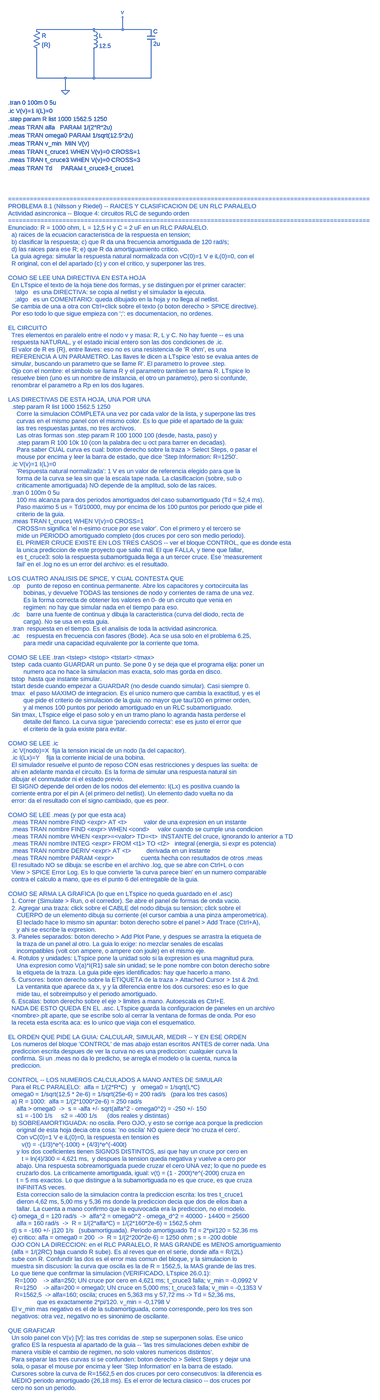
[diagram p0: schematic P8-01_RLC_paralelo_clasificacion.asc, whole sheet]
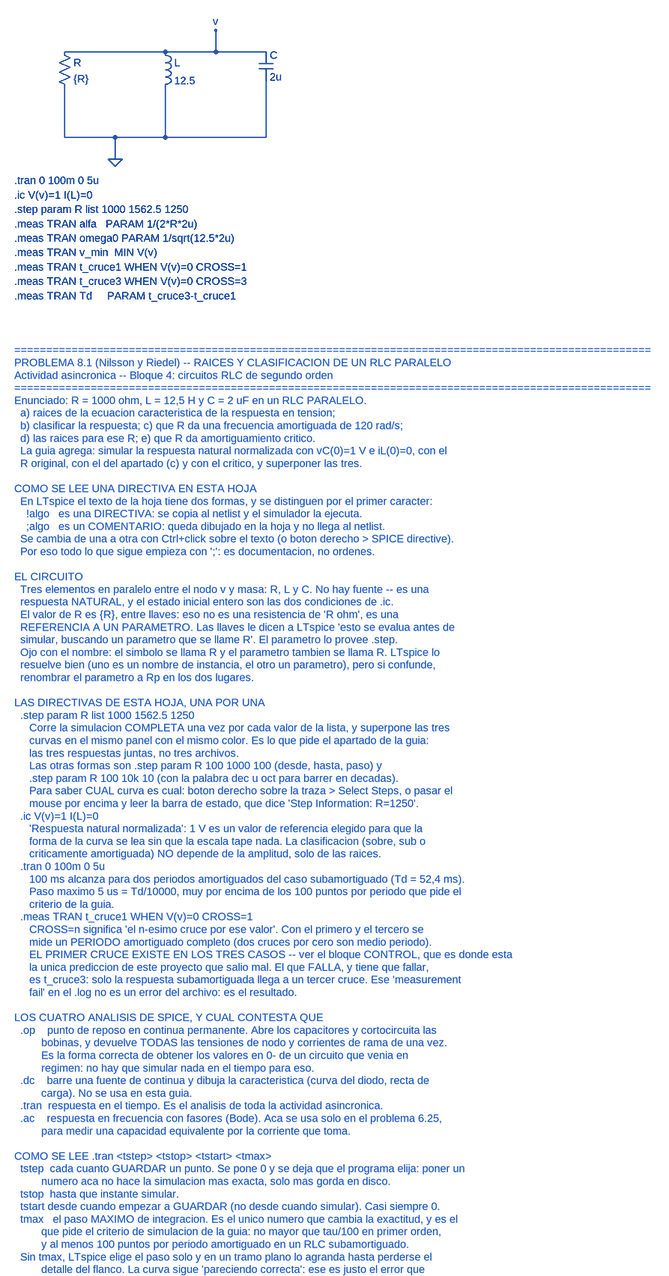
[diagram p1: schematic P8-01_RLC_paralelo_clasificacion.asc, part, row 1 of 2, column 1 of 1]
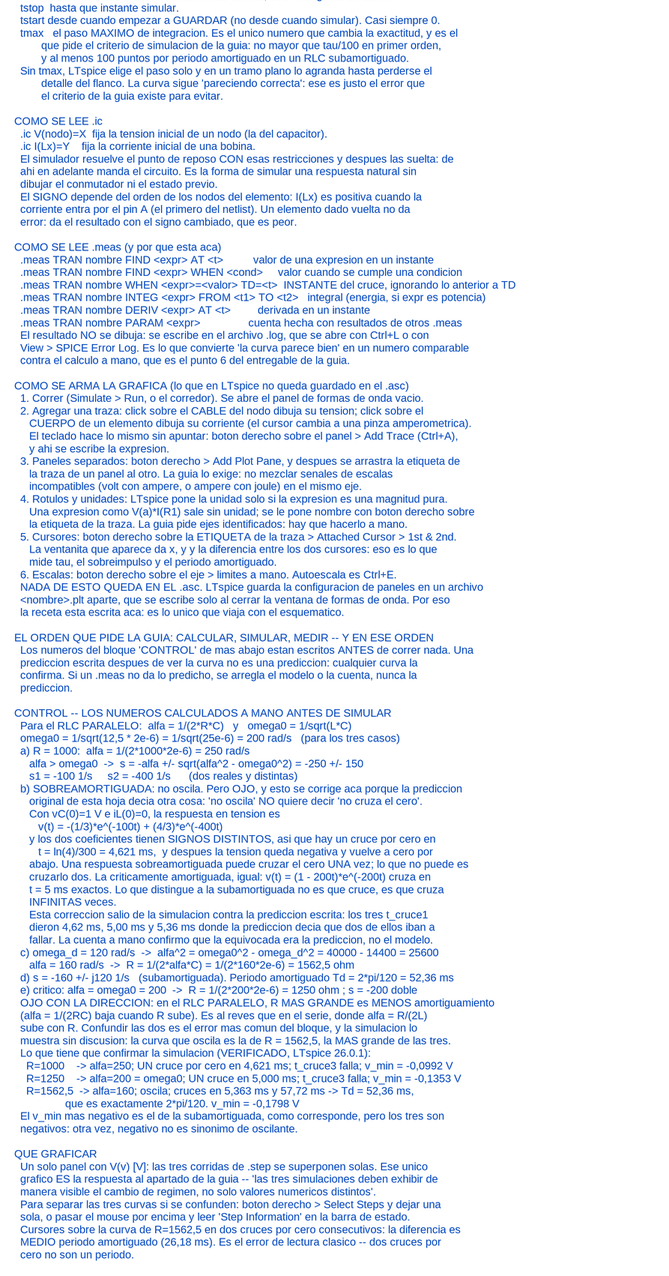
[diagram p2: schematic P8-01_RLC_paralelo_clasificacion.asc, part, row 2 of 2, column 1 of 1]
P8-01_RLC_paralelo_clasificacion.asc, the LTspice schematic file:
Version 4
SHEET 1 2200 2800
WIRE 176 192 176 304
WIRE 400 192 400 304
WIRE 624 176 624 304
WIRE 176 112 624 112
WIRE 176 304 624 304
WIRE 288 304 288 352
WIRE 512 112 512 64
FLAG 288 352 0
FLAG 512 64 v
SYMBOL res 160 96 R0
SYMATTR InstName R
SYMATTR Value {R}
SYMBOL ind 384 96 R0
SYMATTR InstName L
SYMATTR Value 12.5
SYMATTR Value2 Rser=0
SYMBOL cap 608 112 R0
SYMATTR InstName C
SYMATTR Value 2u
TEXT 64 400 Left 2 !.tran 0 100m 0 5u
TEXT 64 432 Left 2 !.ic V(v)=1 I(L)=0
TEXT 64 464 Left 2 !.step param R list 1000 1562.5 1250
TEXT 64 496 Left 2 !.meas TRAN alfa   PARAM 1/(2*R*2u)
TEXT 64 528 Left 2 !.meas TRAN omega0 PARAM 1/sqrt(12.5*2u)
TEXT 64 560 Left 2 !.meas TRAN v_min  MIN V(v)
TEXT 64 592 Left 2 !.meas TRAN t_cruce1 WHEN V(v)=0 CROSS=1
TEXT 64 624 Left 2 !.meas TRAN t_cruce3 WHEN V(v)=0 CROSS=3
TEXT 64 656 Left 2 !.meas TRAN Td     PARAM t_cruce3-t_cruce1
TEXT 64 900 Left 2 ;====================================================================================================
TEXT 64 928 Left 2 ;PROBLEMA 8.1 (Nilsson y Riedel) -- RAICES Y CLASIFICACION DE UN RLC PARALELO
TEXT 64 956 Left 2 ;Actividad asincronica -- Bloque 4: circuitos RLC de segundo orden
TEXT 64 984 Left 2 ;====================================================================================================
TEXT 64 1012 Left 2 ;Enunciado: R = 1000 ohm, L = 12,5 H y C = 2 uF en un RLC PARALELO.
TEXT 64 1040 Left 2 ;  a) raices de la ecuacion caracteristica de la respuesta en tension;
TEXT 64 1068 Left 2 ;  b) clasificar la respuesta; c) que R da una frecuencia amortiguada de 120 rad/s;
TEXT 64 1096 Left 2 ;  d) las raices para ese R; e) que R da amortiguamiento critico.
TEXT 64 1124 Left 2 ;  La guia agrega: simular la respuesta natural normalizada con vC(0)=1 V e iL(0)=0, con el
TEXT 64 1152 Left 2 ;  R original, con el del apartado (c) y con el critico, y superponer las tres.
TEXT 64 1180 Left 2 ;
TEXT 64 1208 Left 2 ;COMO SE LEE UNA DIRECTIVA EN ESTA HOJA
TEXT 64 1236 Left 2 ;  En LTspice el texto de la hoja tiene dos formas, y se distinguen por el primer caracter:
TEXT 64 1264 Left 2 ;    !algo   es una DIRECTIVA: se copia al netlist y el simulador la ejecuta.
TEXT 64 1292 Left 2 ;    ;algo   es un COMENTARIO: queda dibujado en la hoja y no llega al netlist.
TEXT 64 1320 Left 2 ;  Se cambia de una a otra con Ctrl+click sobre el texto (o boton derecho > SPICE directive).
TEXT 64 1348 Left 2 ;  Por eso todo lo que sigue empieza con ';': es documentacion, no ordenes.
TEXT 64 1376 Left 2 ;
TEXT 64 1404 Left 2 ;EL CIRCUITO
TEXT 64 1432 Left 2 ;  Tres elementos en paralelo entre el nodo v y masa: R, L y C. No hay fuente -- es una
TEXT 64 1460 Left 2 ;  respuesta NATURAL, y el estado inicial entero son las dos condiciones de .ic.
TEXT 64 1488 Left 2 ;  El valor de R es {R}, entre llaves: eso no es una resistencia de 'R ohm', es una
TEXT 64 1516 Left 2 ;  REFERENCIA A UN PARAMETRO. Las llaves le dicen a LTspice 'esto se evalua antes de
TEXT 64 1544 Left 2 ;  simular, buscando un parametro que se llame R'. El parametro lo provee .step.
TEXT 64 1572 Left 2 ;  Ojo con el nombre: el simbolo se llama R y el parametro tambien se llama R. LTspice lo
TEXT 64 1600 Left 2 ;  resuelve bien (uno es un nombre de instancia, el otro un parametro), pero si confunde,
TEXT 64 1628 Left 2 ;  renombrar el parametro a Rp en los dos lugares.
TEXT 64 1656 Left 2 ;
TEXT 64 1684 Left 2 ;LAS DIRECTIVAS DE ESTA HOJA, UNA POR UNA
TEXT 64 1712 Left 2 ;  .step param R list 1000 1562.5 1250
TEXT 64 1740 Left 2 ;     Corre la simulacion COMPLETA una vez por cada valor de la lista, y superpone las tres
TEXT 64 1768 Left 2 ;     curvas en el mismo panel con el mismo color. Es lo que pide el apartado de la guia:
TEXT 64 1796 Left 2 ;     las tres respuestas juntas, no tres archivos.
TEXT 64 1824 Left 2 ;     Las otras formas son .step param R 100 1000 100 (desde, hasta, paso) y
TEXT 64 1852 Left 2 ;     .step param R 100 10k 10 (con la palabra dec u oct para barrer en decadas).
TEXT 64 1880 Left 2 ;     Para saber CUAL curva es cual: boton derecho sobre la traza > Select Steps, o pasar el
TEXT 64 1908 Left 2 ;     mouse por encima y leer la barra de estado, que dice 'Step Information: R=1250'.
TEXT 64 1936 Left 2 ;  .ic V(v)=1 I(L)=0
TEXT 64 1964 Left 2 ;     'Respuesta natural normalizada': 1 V es un valor de referencia elegido para que la
TEXT 64 1992 Left 2 ;     forma de la curva se lea sin que la escala tape nada. La clasificacion (sobre, sub o
TEXT 64 2020 Left 2 ;     criticamente amortiguada) NO depende de la amplitud, solo de las raices.
TEXT 64 2048 Left 2 ;  .tran 0 100m 0 5u
TEXT 64 2076 Left 2 ;     100 ms alcanza para dos periodos amortiguados del caso subamortiguado (Td = 52,4 ms).
TEXT 64 2104 Left 2 ;     Paso maximo 5 us = Td/10000, muy por encima de los 100 puntos por periodo que pide el
TEXT 64 2132 Left 2 ;     criterio de la guia.
TEXT 64 2160 Left 2 ;  .meas TRAN t_cruce1 WHEN V(v)=0 CROSS=1
TEXT 64 2188 Left 2 ;     CROSS=n significa 'el n-esimo cruce por ese valor'. Con el primero y el tercero se
TEXT 64 2216 Left 2 ;     mide un PERIODO amortiguado completo (dos cruces por cero son medio periodo).
TEXT 64 2244 Left 2 ;     EL PRIMER CRUCE EXISTE EN LOS TRES CASOS -- ver el bloque CONTROL, que es donde esta
TEXT 64 2272 Left 2 ;     la unica prediccion de este proyecto que salio mal. El que FALLA, y tiene que fallar,
TEXT 64 2300 Left 2 ;     es t_cruce3: solo la respuesta subamortiguada llega a un tercer cruce. Ese 'measurement
TEXT 64 2328 Left 2 ;     fail' en el .log no es un error del archivo: es el resultado.
TEXT 64 2356 Left 2 ;
TEXT 64 2384 Left 2 ;LOS CUATRO ANALISIS DE SPICE, Y CUAL CONTESTA QUE
TEXT 64 2412 Left 2 ;  .op    punto de reposo en continua permanente. Abre los capacitores y cortocircuita las
TEXT 64 2440 Left 2 ;         bobinas, y devuelve TODAS las tensiones de nodo y corrientes de rama de una vez.
TEXT 64 2468 Left 2 ;         Es la forma correcta de obtener los valores en 0- de un circuito que venia en
TEXT 64 2496 Left 2 ;         regimen: no hay que simular nada en el tiempo para eso.
TEXT 64 2524 Left 2 ;  .dc    barre una fuente de continua y dibuja la caracteristica (curva del diodo, recta de
TEXT 64 2552 Left 2 ;         carga). No se usa en esta guia.
TEXT 64 2580 Left 2 ;  .tran  respuesta en el tiempo. Es el analisis de toda la actividad asincronica.
TEXT 64 2608 Left 2 ;  .ac    respuesta en frecuencia con fasores (Bode). Aca se usa solo en el problema 6.25,
TEXT 64 2636 Left 2 ;         para medir una capacidad equivalente por la corriente que toma.
TEXT 64 2664 Left 2 ;
TEXT 64 2692 Left 2 ;COMO SE LEE .tran <tstep> <tstop> <tstart> <tmax>
TEXT 64 2720 Left 2 ;  tstep  cada cuanto GUARDAR un punto. Se pone 0 y se deja que el programa elija: poner un
TEXT 64 2748 Left 2 ;         numero aca no hace la simulacion mas exacta, solo mas gorda en disco.
TEXT 64 2776 Left 2 ;  tstop  hasta que instante simular.
TEXT 64 2804 Left 2 ;  tstart desde cuando empezar a GUARDAR (no desde cuando simular). Casi siempre 0.
TEXT 64 2832 Left 2 ;  tmax   el paso MAXIMO de integracion. Es el unico numero que cambia la exactitud, y es el
TEXT 64 2860 Left 2 ;         que pide el criterio de simulacion de la guia: no mayor que tau/100 en primer orden,
TEXT 64 2888 Left 2 ;         y al menos 100 puntos por periodo amortiguado en un RLC subamortiguado.
TEXT 64 2916 Left 2 ;  Sin tmax, LTspice elige el paso solo y en un tramo plano lo agranda hasta perderse el
TEXT 64 2944 Left 2 ;         detalle del flanco. La curva sigue 'pareciendo correcta': ese es justo el error que
TEXT 64 2972 Left 2 ;         el criterio de la guia existe para evitar.
TEXT 64 3000 Left 2 ;
TEXT 64 3028 Left 2 ;COMO SE LEE .ic
TEXT 64 3056 Left 2 ;  .ic V(nodo)=X  fija la tension inicial de un nodo (la del capacitor).
TEXT 64 3084 Left 2 ;  .ic I(Lx)=Y    fija la corriente inicial de una bobina.
TEXT 64 3112 Left 2 ;  El simulador resuelve el punto de reposo CON esas restricciones y despues las suelta: de
TEXT 64 3140 Left 2 ;  ahi en adelante manda el circuito. Es la forma de simular una respuesta natural sin
TEXT 64 3168 Left 2 ;  dibujar el conmutador ni el estado previo.
TEXT 64 3196 Left 2 ;  El SIGNO depende del orden de los nodos del elemento: I(Lx) es positiva cuando la
TEXT 64 3224 Left 2 ;  corriente entra por el pin A (el primero del netlist). Un elemento dado vuelta no da
TEXT 64 3252 Left 2 ;  error: da el resultado con el signo cambiado, que es peor.
TEXT 64 3280 Left 2 ;
TEXT 64 3308 Left 2 ;COMO SE LEE .meas (y por que esta aca)
TEXT 64 3336 Left 2 ;  .meas TRAN nombre FIND <expr> AT <t>          valor de una expresion en un instante
TEXT 64 3364 Left 2 ;  .meas TRAN nombre FIND <expr> WHEN <cond>     valor cuando se cumple una condicion
TEXT 64 3392 Left 2 ;  .meas TRAN nombre WHEN <expr>=<valor> TD=<t>  INSTANTE del cruce, ignorando lo anterior a TD
TEXT 64 3420 Left 2 ;  .meas TRAN nombre INTEG <expr> FROM <t1> TO <t2>   integral (energia, si expr es potencia)
TEXT 64 3448 Left 2 ;  .meas TRAN nombre DERIV <expr> AT <t>         derivada en un instante
TEXT 64 3476 Left 2 ;  .meas TRAN nombre PARAM <expr>                cuenta hecha con resultados de otros .meas
TEXT 64 3504 Left 2 ;  El resultado NO se dibuja: se escribe en el archivo .log, que se abre con Ctrl+L o con
TEXT 64 3532 Left 2 ;  View > SPICE Error Log. Es lo que convierte 'la curva parece bien' en un numero comparable
TEXT 64 3560 Left 2 ;  contra el calculo a mano, que es el punto 6 del entregable de la guia.
TEXT 64 3588 Left 2 ;
TEXT 64 3616 Left 2 ;COMO SE ARMA LA GRAFICA (lo que en LTspice no queda guardado en el .asc)
TEXT 64 3644 Left 2 ;  1. Correr (Simulate > Run, o el corredor). Se abre el panel de formas de onda vacio.
TEXT 64 3672 Left 2 ;  2. Agregar una traza: click sobre el CABLE del nodo dibuja su tension; click sobre el
TEXT 64 3700 Left 2 ;     CUERPO de un elemento dibuja su corriente (el cursor cambia a una pinza amperometrica).
TEXT 64 3728 Left 2 ;     El teclado hace lo mismo sin apuntar: boton derecho sobre el panel > Add Trace (Ctrl+A),
TEXT 64 3756 Left 2 ;     y ahi se escribe la expresion.
TEXT 64 3784 Left 2 ;  3. Paneles separados: boton derecho > Add Plot Pane, y despues se arrastra la etiqueta de
TEXT 64 3812 Left 2 ;     la traza de un panel al otro. La guia lo exige: no mezclar senales de escalas
TEXT 64 3840 Left 2 ;     incompatibles (volt con ampere, o ampere con joule) en el mismo eje.
TEXT 64 3868 Left 2 ;  4. Rotulos y unidades: LTspice pone la unidad solo si la expresion es una magnitud pura.
TEXT 64 3896 Left 2 ;     Una expresion como V(a)*I(R1) sale sin unidad; se le pone nombre con boton derecho sobre
TEXT 64 3924 Left 2 ;     la etiqueta de la traza. La guia pide ejes identificados: hay que hacerlo a mano.
TEXT 64 3952 Left 2 ;  5. Cursores: boton derecho sobre la ETIQUETA de la traza > Attached Cursor > 1st & 2nd.
TEXT 64 3980 Left 2 ;     La ventanita que aparece da x, y y la diferencia entre los dos cursores: eso es lo que
TEXT 64 4008 Left 2 ;     mide tau, el sobreimpulso y el periodo amortiguado.
TEXT 64 4036 Left 2 ;  6. Escalas: boton derecho sobre el eje > limites a mano. Autoescala es Ctrl+E.
TEXT 64 4064 Left 2 ;  NADA DE ESTO QUEDA EN EL .asc. LTspice guarda la configuracion de paneles en un archivo
TEXT 64 4092 Left 2 ;  <nombre>.plt aparte, que se escribe solo al cerrar la ventana de formas de onda. Por eso
TEXT 64 4120 Left 2 ;  la receta esta escrita aca: es lo unico que viaja con el esquematico.
TEXT 64 4148 Left 2 ;
TEXT 64 4176 Left 2 ;EL ORDEN QUE PIDE LA GUIA: CALCULAR, SIMULAR, MEDIR -- Y EN ESE ORDEN
TEXT 64 4204 Left 2 ;  Los numeros del bloque 'CONTROL' de mas abajo estan escritos ANTES de correr nada. Una
TEXT 64 4232 Left 2 ;  prediccion escrita despues de ver la curva no es una prediccion: cualquier curva la
TEXT 64 4260 Left 2 ;  confirma. Si un .meas no da lo predicho, se arregla el modelo o la cuenta, nunca la
TEXT 64 4288 Left 2 ;  prediccion.
TEXT 64 4316 Left 2 ;
TEXT 64 4344 Left 2 ;CONTROL -- LOS NUMEROS CALCULADOS A MANO ANTES DE SIMULAR
TEXT 64 4372 Left 2 ;  Para el RLC PARALELO:  alfa = 1/(2*R*C)   y   omega0 = 1/sqrt(L*C)
TEXT 64 4400 Left 2 ;  omega0 = 1/sqrt(12,5 * 2e-6) = 1/sqrt(25e-6) = 200 rad/s   (para los tres casos)
TEXT 64 4428 Left 2 ;  a) R = 1000:  alfa = 1/(2*1000*2e-6) = 250 rad/s
TEXT 64 4456 Left 2 ;     alfa > omega0  ->  s = -alfa +/- sqrt(alfa^2 - omega0^2) = -250 +/- 150
TEXT 64 4484 Left 2 ;     s1 = -100 1/s     s2 = -400 1/s      (dos reales y distintas)
TEXT 64 4512 Left 2 ;  b) SOBREAMORTIGUADA: no oscila. Pero OJO, y esto se corrige aca porque la prediccion
TEXT 64 4540 Left 2 ;     original de esta hoja decia otra cosa: 'no oscila' NO quiere decir 'no cruza el cero'.
TEXT 64 4568 Left 2 ;     Con vC(0)=1 V e iL(0)=0, la respuesta en tension es
TEXT 64 4596 Left 2 ;        v(t) = -(1/3)*e^(-100t) + (4/3)*e^(-400t)
TEXT 64 4624 Left 2 ;     y los dos coeficientes tienen SIGNOS DISTINTOS, asi que hay un cruce por cero en
TEXT 64 4652 Left 2 ;        t = ln(4)/300 = 4,621 ms,  y despues la tension queda negativa y vuelve a cero por
TEXT 64 4680 Left 2 ;     abajo. Una respuesta sobreamortiguada puede cruzar el cero UNA vez; lo que no puede es
TEXT 64 4708 Left 2 ;     cruzarlo dos. La criticamente amortiguada, igual: v(t) = (1 - 200t)*e^(-200t) cruza en
TEXT 64 4736 Left 2 ;     t = 5 ms exactos. Lo que distingue a la subamortiguada no es que cruce, es que cruza
TEXT 64 4764 Left 2 ;     INFINITAS veces.
TEXT 64 4792 Left 2 ;     Esta correccion salio de la simulacion contra la prediccion escrita: los tres t_cruce1
TEXT 64 4820 Left 2 ;     dieron 4,62 ms, 5,00 ms y 5,36 ms donde la prediccion decia que dos de ellos iban a
TEXT 64 4848 Left 2 ;     fallar. La cuenta a mano confirmo que la equivocada era la prediccion, no el modelo.
TEXT 64 4876 Left 2 ;  c) omega_d = 120 rad/s  ->  alfa^2 = omega0^2 - omega_d^2 = 40000 - 14400 = 25600
TEXT 64 4904 Left 2 ;     alfa = 160 rad/s  ->  R = 1/(2*alfa*C) = 1/(2*160*2e-6) = 1562,5 ohm
TEXT 64 4932 Left 2 ;  d) s = -160 +/- j120 1/s   (subamortiguada). Periodo amortiguado Td = 2*pi/120 = 52,36 ms
TEXT 64 4960 Left 2 ;  e) critico: alfa = omega0 = 200  ->  R = 1/(2*200*2e-6) = 1250 ohm ; s = -200 doble
TEXT 64 4988 Left 2 ;  OJO CON LA DIRECCION: en el RLC PARALELO, R MAS GRANDE es MENOS amortiguamiento
TEXT 64 5016 Left 2 ;  (alfa = 1/(2RC) baja cuando R sube). Es al reves que en el serie, donde alfa = R/(2L)
TEXT 64 5044 Left 2 ;  sube con R. Confundir las dos es el error mas comun del bloque, y la simulacion lo
TEXT 64 5072 Left 2 ;  muestra sin discusion: la curva que oscila es la de R = 1562,5, la MAS grande de las tres.
TEXT 64 5100 Left 2 ;  Lo que tiene que confirmar la simulacion (VERIFICADO, LTspice 26.0.1):
TEXT 64 5128 Left 2 ;    R=1000    -> alfa=250; UN cruce por cero en 4,621 ms; t_cruce3 falla; v_min = -0,0992 V
TEXT 64 5156 Left 2 ;    R=1250    -> alfa=200 = omega0; UN cruce en 5,000 ms; t_cruce3 falla; v_min = -0,1353 V
TEXT 64 5184 Left 2 ;    R=1562,5  -> alfa=160; oscila; cruces en 5,363 ms y 57,72 ms -> Td = 52,36 ms,
TEXT 64 5212 Left 2 ;                 que es exactamente 2*pi/120. v_min = -0,1798 V
TEXT 64 5240 Left 2 ;  El v_min mas negativo es el de la subamortiguada, como corresponde, pero los tres son
TEXT 64 5268 Left 2 ;  negativos: otra vez, negativo no es sinonimo de oscilante.
TEXT 64 5296 Left 2 ;
TEXT 64 5324 Left 2 ;QUE GRAFICAR
TEXT 64 5352 Left 2 ;  Un solo panel con V(v) [V]: las tres corridas de .step se superponen solas. Ese unico
TEXT 64 5380 Left 2 ;  grafico ES la respuesta al apartado de la guia -- 'las tres simulaciones deben exhibir de
TEXT 64 5408 Left 2 ;  manera visible el cambio de regimen, no solo valores numericos distintos'.
TEXT 64 5436 Left 2 ;  Para separar las tres curvas si se confunden: boton derecho > Select Steps y dejar una
TEXT 64 5464 Left 2 ;  sola, o pasar el mouse por encima y leer 'Step Information' en la barra de estado.
TEXT 64 5492 Left 2 ;  Cursores sobre la curva de R=1562,5 en dos cruces por cero consecutivos: la diferencia es
TEXT 64 5520 Left 2 ;  MEDIO periodo amortiguado (26,18 ms). Es el error de lectura clasico -- dos cruces por
TEXT 64 5548 Left 2 ;  cero no son un periodo.

The netlist it stands for:
* P8-01_RLC_paralelo_clasificacion.asc
R v 0 {R}
L v 0 12.5 Rser=0
C v 0 2u
.tran 0 100m 0 5u
.ic V(v)=1 I(L)=0
.step param R list 1000 1562.5 1250
.meas TRAN alfa   PARAM 1/(2*R*2u)
.meas TRAN omega0 PARAM 1/sqrt(12.5*2u)
.meas TRAN v_min  MIN V(v)
.meas TRAN t_cruce1 WHEN V(v)=0 CROSS=1
.meas TRAN t_cruce3 WHEN V(v)=0 CROSS=3
.meas TRAN Td     PARAM t_cruce3-t_cruce1
* ====================================================================================================
* PROBLEMA 8.1 (Nilsson y Riedel) -- RAICES Y CLASIFICACION DE UN RLC PARALELO
* Actividad asincronica -- Bloque 4: circuitos RLC de segundo orden
* ====================================================================================================
* Enunciado: R = 1000 ohm, L = 12,5 H y C = 2 uF en un RLC PARALELO.
*   a) raices de la ecuacion caracteristica de la respuesta en tension;
*   b) clasificar la respuesta; c) que R da una frecuencia amortiguada de 120 rad/s;
*   d) las raices para ese R; e) que R da amortiguamiento critico.
*   La guia agrega: simular la respuesta natural normalizada con vC(0)=1 V e iL(0)=0, con el
*   R original, con el del apartado (c) y con el critico, y superponer las tres.
* COMO SE LEE UNA DIRECTIVA EN ESTA HOJA
*   En LTspice el texto de la hoja tiene dos formas, y se distinguen por el primer caracter:
*     !algo   es una DIRECTIVA: se copia al netlist y el simulador la ejecuta.
*     ;algo   es un COMENTARIO: queda dibujado en la hoja y no llega al netlist.
*   Se cambia de una a otra con Ctrl+click sobre el texto (o boton derecho > SPICE directive).
*   Por eso todo lo que sigue empieza con ';': es documentacion, no ordenes.
* EL CIRCUITO
*   Tres elementos en paralelo entre el nodo v y masa: R, L y C. No hay fuente -- es una
*   respuesta NATURAL, y el estado inicial entero son las dos condiciones de .ic.
*   El valor de R es {R}, entre llaves: eso no es una resistencia de 'R ohm', es una
*   REFERENCIA A UN PARAMETRO. Las llaves le dicen a LTspice 'esto se evalua antes de
*   simular, buscando un parametro que se llame R'. El parametro lo provee .step.
*   Ojo con el nombre: el simbolo se llama R y el parametro tambien se llama R. LTspice lo
*   resuelve bien (uno es un nombre de instancia, el otro un parametro), pero si confunde,
*   renombrar el parametro a Rp en los dos lugares.
* LAS DIRECTIVAS DE ESTA HOJA, UNA POR UNA
*   .step param R list 1000 1562.5 1250
*      Corre la simulacion COMPLETA una vez por cada valor de la lista, y superpone las tres
*      curvas en el mismo panel con el mismo color. Es lo que pide el apartado de la guia:
*      las tres respuestas juntas, no tres archivos.
*      Las otras formas son .step param R 100 1000 100 (desde, hasta, paso) y
*      .step param R 100 10k 10 (con la palabra dec u oct para barrer en decadas).
*      Para saber CUAL curva es cual: boton derecho sobre la traza > Select Steps, o pasar el
*      mouse por encima y leer la barra de estado, que dice 'Step Information: R=1250'.
*   .ic V(v)=1 I(L)=0
*      'Respuesta natural normalizada': 1 V es un valor de referencia elegido para que la
*      forma de la curva se lea sin que la escala tape nada. La clasificacion (sobre, sub o
*      criticamente amortiguada) NO depende de la amplitud, solo de las raices.
*   .tran 0 100m 0 5u
*      100 ms alcanza para dos periodos amortiguados del caso subamortiguado (Td = 52,4 ms).
*      Paso maximo 5 us = Td/10000, muy por encima de los 100 puntos por periodo que pide el
*      criterio de la guia.
*   .meas TRAN t_cruce1 WHEN V(v)=0 CROSS=1
*      CROSS=n significa 'el n-esimo cruce por ese valor'. Con el primero y el tercero se
*      mide un PERIODO amortiguado completo (dos cruces por cero son medio periodo).
*      EL PRIMER CRUCE EXISTE EN LOS TRES CASOS -- ver el bloque CONTROL, que es donde esta
*      la unica prediccion de este proyecto que salio mal. El que FALLA, y tiene que fallar,
*      es t_cruce3: solo la respuesta subamortiguada llega a un tercer cruce. Ese 'measurement
*      fail' en el .log no es un error del archivo: es el resultado.
* LOS CUATRO ANALISIS DE SPICE, Y CUAL CONTESTA QUE
*   .op    punto de reposo en continua permanente. Abre los capacitores y cortocircuita las
*          bobinas, y devuelve TODAS las tensiones de nodo y corrientes de rama de una vez.
*          Es la forma correcta de obtener los valores en 0- de un circuito que venia en
*          regimen: no hay que simular nada en el tiempo para eso.
*   .dc    barre una fuente de continua y dibuja la caracteristica (curva del diodo, recta de
*          carga). No se usa en esta guia.
*   .tran  respuesta en el tiempo. Es el analisis de toda la actividad asincronica.
*   .ac    respuesta en frecuencia con fasores (Bode). Aca se usa solo en el problema 6.25,
*          para medir una capacidad equivalente por la corriente que toma.
* COMO SE LEE .tran <tstep> <tstop> <tstart> <tmax>
*   tstep  cada cuanto GUARDAR un punto. Se pone 0 y se deja que el programa elija: poner un
*          numero aca no hace la simulacion mas exacta, solo mas gorda en disco.
*   tstop  hasta que instante simular.
*   tstart desde cuando empezar a GUARDAR (no desde cuando simular). Casi siempre 0.
*   tmax   el paso MAXIMO de integracion. Es el unico numero que cambia la exactitud, y es el
*          que pide el criterio de simulacion de la guia: no mayor que tau/100 en primer orden,
*          y al menos 100 puntos por periodo amortiguado en un RLC subamortiguado.
*   Sin tmax, LTspice elige el paso solo y en un tramo plano lo agranda hasta perderse el
*          detalle del flanco. La curva sigue 'pareciendo correcta': ese es justo el error que
*          el criterio de la guia existe para evitar.
* COMO SE LEE .ic
*   .ic V(nodo)=X  fija la tension inicial de un nodo (la del capacitor).
*   .ic I(Lx)=Y    fija la corriente inicial de una bobina.
*   El simulador resuelve el punto de reposo CON esas restricciones y despues las suelta: de
*   ahi en adelante manda el circuito. Es la forma de simular una respuesta natural sin
*   dibujar el conmutador ni el estado previo.
*   El SIGNO depende del orden de los nodos del elemento: I(Lx) es positiva cuando la
*   corriente entra por el pin A (el primero del netlist). Un elemento dado vuelta no da
*   error: da el resultado con el signo cambiado, que es peor.
* COMO SE LEE .meas (y por que esta aca)
*   .meas TRAN nombre FIND <expr> AT <t>          valor de una expresion en un instante
*   .meas TRAN nombre FIND <expr> WHEN <cond>     valor cuando se cumple una condicion
*   .meas TRAN nombre WHEN <expr>=<valor> TD=<t>  INSTANTE del cruce, ignorando lo anterior a TD
*   .meas TRAN nombre INTEG <expr> FROM <t1> TO <t2>   integral (energia, si expr es potencia)
*   .meas TRAN nombre DERIV <expr> AT <t>         derivada en un instante
*   .meas TRAN nombre PARAM <expr>                cuenta hecha con resultados de otros .meas
*   El resultado NO se dibuja: se escribe en el archivo .log, que se abre con Ctrl+L o con
*   View > SPICE Error Log. Es lo que convierte 'la curva parece bien' en un numero comparable
*   contra el calculo a mano, que es el punto 6 del entregable de la guia.
* COMO SE ARMA LA GRAFICA (lo que en LTspice no queda guardado en el .asc)
*   1. Correr (Simulate > Run, o el corredor). Se abre el panel de formas de onda vacio.
*   2. Agregar una traza: click sobre el CABLE del nodo dibuja su tension; click sobre el
*      CUERPO de un elemento dibuja su corriente (el cursor cambia a una pinza amperometrica).
*      El teclado hace lo mismo sin apuntar: boton derecho sobre el panel > Add Trace (Ctrl+A),
*      y ahi se escribe la expresion.
*   3. Paneles separados: boton derecho > Add Plot Pane, y despues se arrastra la etiqueta de
*      la traza de un panel al otro. La guia lo exige: no mezclar senales de escalas
*      incompatibles (volt con ampere, o ampere con joule) en el mismo eje.
*   4. Rotulos y unidades: LTspice pone la unidad solo si la expresion es una magnitud pura.
*      Una expresion como V(a)*I(R1) sale sin unidad; se le pone nombre con boton derecho sobre
*      la etiqueta de la traza. La guia pide ejes identificados: hay que hacerlo a mano.
*   5. Cursores: boton derecho sobre la ETIQUETA de la traza > Attached Cursor > 1st & 2nd.
*      La ventanita que aparece da x, y y la diferencia entre los dos cursores: eso es lo que
*      mide tau, el sobreimpulso y el periodo amortiguado.
*   6. Escalas: boton derecho sobre el eje > limites a mano. Autoescala es Ctrl+E.
*   NADA DE ESTO QUEDA EN EL .asc. LTspice guarda la configuracion de paneles en un archivo
*   <nombre>.plt aparte, que se escribe solo al cerrar la ventana de formas de onda. Por eso
*   la receta esta escrita aca: es lo unico que viaja con el esquematico.
* EL ORDEN QUE PIDE LA GUIA: CALCULAR, SIMULAR, MEDIR -- Y EN ESE ORDEN
*   Los numeros del bloque 'CONTROL' de mas abajo estan escritos ANTES de correr nada. Una
*   prediccion escrita despues de ver la curva no es una prediccion: cualquier curva la
*   confirma. Si un .meas no da lo predicho, se arregla el modelo o la cuenta, nunca la
*   prediccion.
* CONTROL -- LOS NUMEROS CALCULADOS A MANO ANTES DE SIMULAR
*   Para el RLC PARALELO:  alfa = 1/(2*R*C)   y   omega0 = 1/sqrt(L*C)
*   omega0 = 1/sqrt(12,5 * 2e-6) = 1/sqrt(25e-6) = 200 rad/s   (para los tres casos)
*   a) R = 1000:  alfa = 1/(2*1000*2e-6) = 250 rad/s
*      alfa > omega0  ->  s = -alfa +/- sqrt(alfa^2 - omega0^2) = -250 +/- 150
*      s1 = -100 1/s     s2 = -400 1/s      (dos reales y distintas)
*   b) SOBREAMORTIGUADA: no oscila. Pero OJO, y esto se corrige aca porque la prediccion
*      original de esta hoja decia otra cosa: 'no oscila' NO quiere decir 'no cruza el cero'.
*      Con vC(0)=1 V e iL(0)=0, la respuesta en tension es
*         v(t) = -(1/3)*e^(-100t) + (4/3)*e^(-400t)
*      y los dos coeficientes tienen SIGNOS DISTINTOS, asi que hay un cruce por cero en
*         t = ln(4)/300 = 4,621 ms,  y despues la tension queda negativa y vuelve a cero por
*      abajo. Una respuesta sobreamortiguada puede cruzar el cero UNA vez; lo que no puede es
*      cruzarlo dos. La criticamente amortiguada, igual: v(t) = (1 - 200t)*e^(-200t) cruza en
*      t = 5 ms exactos. Lo que distingue a la subamortiguada no es que cruce, es que cruza
*      INFINITAS veces.
*      Esta correccion salio de la simulacion contra la prediccion escrita: los tres t_cruce1
*      dieron 4,62 ms, 5,00 ms y 5,36 ms donde la prediccion decia que dos de ellos iban a
*      fallar. La cuenta a mano confirmo que la equivocada era la prediccion, no el modelo.
*   c) omega_d = 120 rad/s  ->  alfa^2 = omega0^2 - omega_d^2 = 40000 - 14400 = 25600
*      alfa = 160 rad/s  ->  R = 1/(2*alfa*C) = 1/(2*160*2e-6) = 1562,5 ohm
*   d) s = -160 +/- j120 1/s   (subamortiguada). Periodo amortiguado Td = 2*pi/120 = 52,36 ms
*   e) critico: alfa = omega0 = 200  ->  R = 1/(2*200*2e-6) = 1250 ohm ; s = -200 doble
*   OJO CON LA DIRECCION: en el RLC PARALELO, R MAS GRANDE es MENOS amortiguamiento
*   (alfa = 1/(2RC) baja cuando R sube). Es al reves que en el serie, donde alfa = R/(2L)
*   sube con R. Confundir las dos es el error mas comun del bloque, y la simulacion lo
*   muestra sin discusion: la curva que oscila es la de R = 1562,5, la MAS grande de las tres.
*   Lo que tiene que confirmar la simulacion (VERIFICADO, LTspice 26.0.1):
*     R=1000    -> alfa=250; UN cruce por cero en 4,621 ms; t_cruce3 falla; v_min = -0,0992 V
*     R=1250    -> alfa=200 = omega0; UN cruce en 5,000 ms; t_cruce3 falla; v_min = -0,1353 V
*     R=1562,5  -> alfa=160; oscila; cruces en 5,363 ms y 57,72 ms -> Td = 52,36 ms,
*                  que es exactamente 2*pi/120. v_min = -0,1798 V
*   El v_min mas negativo es el de la subamortiguada, como corresponde, pero los tres son
*   negativos: otra vez, negativo no es sinonimo de oscilante.
* QUE GRAFICAR
*   Un solo panel con V(v) [V]: las tres corridas de .step se superponen solas. Ese unico
*   grafico ES la respuesta al apartado de la guia -- 'las tres simulaciones deben exhibir de
*   manera visible el cambio de regimen, no solo valores numericos distintos'.
*   Para separar las tres curvas si se confunden: boton derecho > Select Steps y dejar una
*   sola, o pasar el mouse por encima y leer 'Step Information' en la barra de estado.
*   Cursores sobre la curva de R=1562,5 en dos cruces por cero consecutivos: la diferencia es
*   MEDIO periodo amortiguado (26,18 ms). Es el error de lectura clasico -- dos cruces por
*   cero no son un periodo.
.backanno
.end